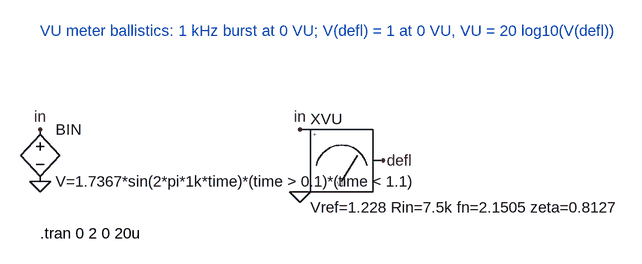
[diagram p0: schematic demo_vu.asc]
demo_vu.asc, the LTspice schematic file:
Version 4
SHEET 1 800 400
FLAG 0 112 in
FLAG 0 192 0
FLAG 400 112 in
FLAG 400 208 0
FLAG 528 160 defl
SYMBOL bv 0 96 R0
SYMATTR InstName BIN
SYMATTR Value V=1.7367*sin(2*pi*1k*time)*(time > 0.1)*(time < 1.1)
SYMBOL vu_meter 400 96 R0
SYMATTR InstName XVU
TEXT 0 272 Left 2 !.tran 0 2 0 20u
TEXT 0 -40 Left 2 ;VU meter ballistics: 1 kHz burst at 0 VU; V(defl) = 1 at 0 VU, VU = 20 log10(V(defl))

The netlist it stands for:
* demo_vu.asc
BIN in 0 V=1.7367*sin(2*pi*1k*time)*(time > 0.1)*(time < 1.1)
XXVU in 0 defl vu_meter Vref=1.228 Rin=7.5k fn=2.1505 zeta=0.8127  ; pins P N DEFL
.tran 0 2 0 20u
* VU meter ballistics: 1 kHz burst at 0 VU; V(defl) = 1 at 0 VU, VU = 20 log10(V(defl))
.lib vu.sub
.backanno
.end